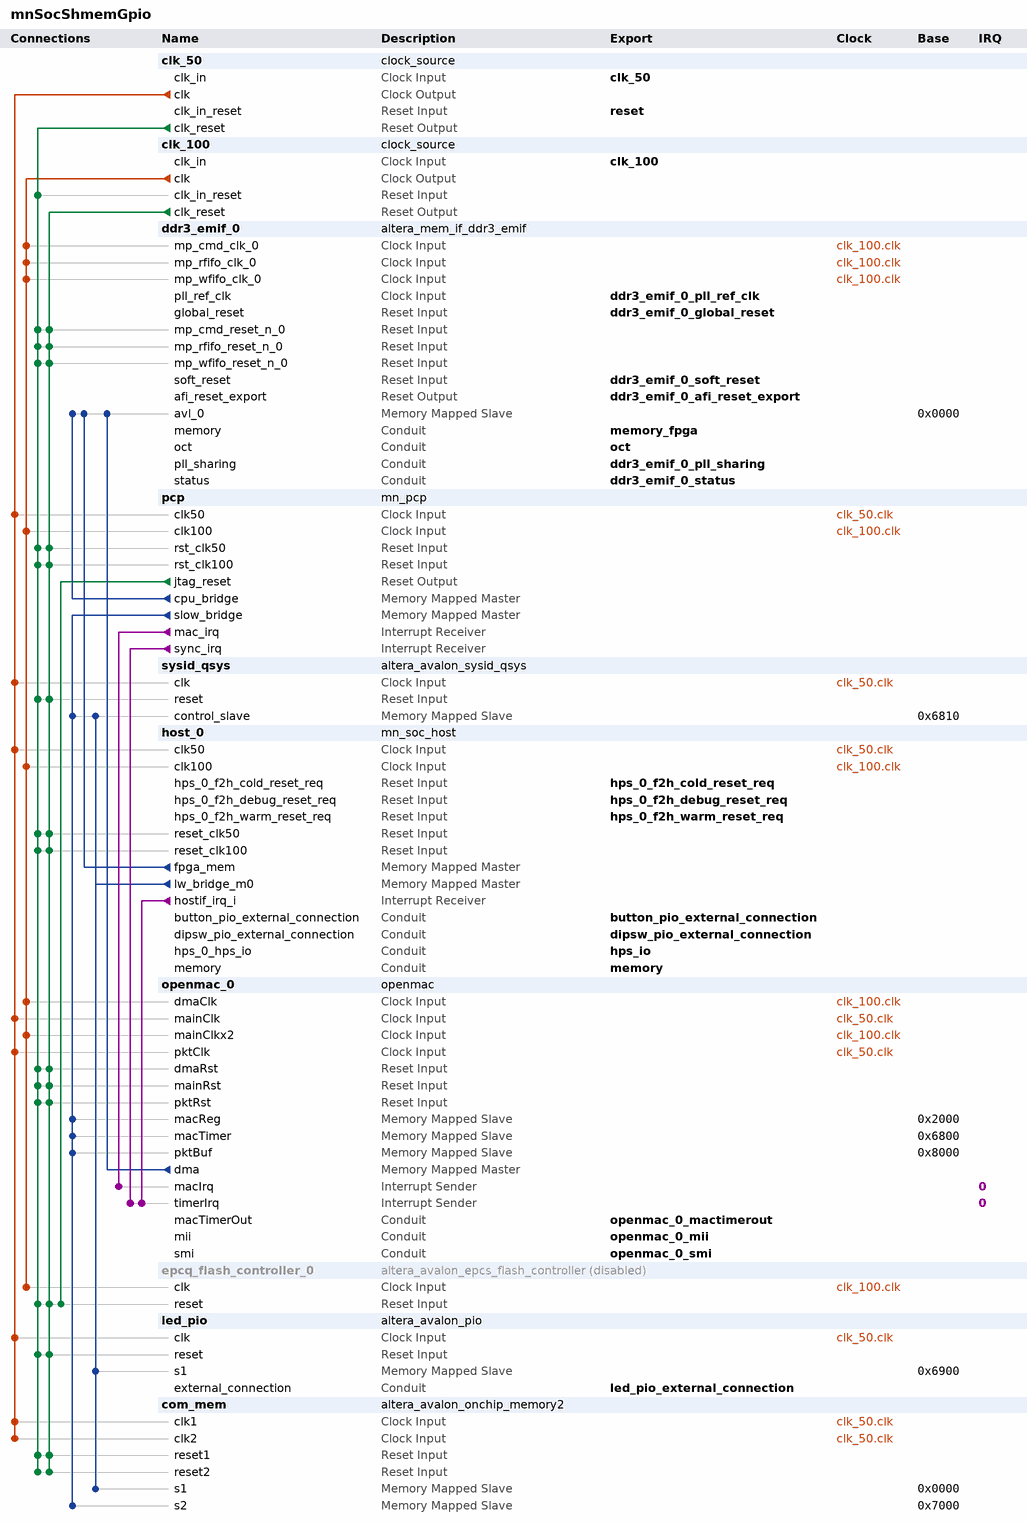
[diagram p0: system contents]
# Platform Designer (Qsys) system mnSocShmemGpio, Cyclone V 5CSXFC6D6F31C6
# Parameters at their usual value, and those the tool derives, are not listed.
package require -exact qsys 14.1
create_system mnSocShmemGpio
set_project_property DEVICE_FAMILY {Cyclone V}
set_project_property DEVICE 5CSXFC6D6F31C6

add_instance clk_50 clock_source 14.1
set_instance_parameter_value clk_50 clockFrequency 50000000
set_instance_parameter_value clk_50 resetSynchronousEdges DEASSERT

add_instance clk_100 clock_source 14.1
set_instance_parameter_value clk_100 clockFrequency 100000000

add_instance ddr3_emif_0 altera_mem_if_ddr3_emif 14.1
set_instance_parameter_value ddr3_emif_0 ADDR_ORDER 2
set_instance_parameter_value ddr3_emif_0 AVL_MAX_SIZE 1
set_instance_parameter_value ddr3_emif_0 CALIBRATION_MODE Skip
set_instance_parameter_value ddr3_emif_0 CPORT_TYPE_PORT Bidirectional,Bidirectional,Bidirectional,Bidirectional,Bidirectional,Bidirectional
set_instance_parameter_value ddr3_emif_0 EXPORT_AFI_HALF_CLK true
set_instance_parameter_value ddr3_emif_0 HARD_EMIF true
set_instance_parameter_value ddr3_emif_0 MEM_BANKADDR_WIDTH 3
set_instance_parameter_value ddr3_emif_0 MEM_CLK_FREQ 300.0
set_instance_parameter_value ddr3_emif_0 MEM_CLK_FREQ_MAX 800.0
set_instance_parameter_value ddr3_emif_0 MEM_COL_ADDR_WIDTH 10
set_instance_parameter_value ddr3_emif_0 MEM_DQ_WIDTH 32
set_instance_parameter_value ddr3_emif_0 MEM_DRV_STR RZQ/6
set_instance_parameter_value ddr3_emif_0 MEM_FORMAT DISCRETE
set_instance_parameter_value ddr3_emif_0 MEM_ROW_ADDR_WIDTH 12
set_instance_parameter_value ddr3_emif_0 MEM_RTT_NOM {ODT Disabled}
set_instance_parameter_value ddr3_emif_0 MEM_RTT_WR {Dynamic ODT off}
set_instance_parameter_value ddr3_emif_0 MEM_TCL 6
set_instance_parameter_value ddr3_emif_0 MEM_TFAW_NS 40.0
set_instance_parameter_value ddr3_emif_0 MEM_TRAS_NS 35.0
set_instance_parameter_value ddr3_emif_0 MEM_TRCD_NS 13.75
set_instance_parameter_value ddr3_emif_0 MEM_TRFC_NS 260.0
set_instance_parameter_value ddr3_emif_0 MEM_TRP_NS 13.75
set_instance_parameter_value ddr3_emif_0 MEM_TRRD_NS 13.5
set_instance_parameter_value ddr3_emif_0 MEM_TRTP_NS 13.5
set_instance_parameter_value ddr3_emif_0 MEM_TWTR 4
set_instance_parameter_value ddr3_emif_0 MEM_VENDOR Micron
set_instance_parameter_value ddr3_emif_0 MEM_WTCL 5
set_instance_parameter_value ddr3_emif_0 PLL_LOCATION Top_Bottom
set_instance_parameter_value ddr3_emif_0 POWER_OF_TWO_BUS false
set_instance_parameter_value ddr3_emif_0 PRIORITY_PORT 1,1,1,1,1,1
set_instance_parameter_value ddr3_emif_0 RATE Full
set_instance_parameter_value ddr3_emif_0 REF_CLK_FREQ 50.0
set_instance_parameter_value ddr3_emif_0 SPEED_GRADE 8
set_instance_parameter_value ddr3_emif_0 TIMING_BOARD_AC_SKEW 0.02
set_instance_parameter_value ddr3_emif_0 TIMING_BOARD_AC_TO_CK_SKEW 0.0
set_instance_parameter_value ddr3_emif_0 TIMING_BOARD_DQ_TO_DQS_SKEW 0.0
set_instance_parameter_value ddr3_emif_0 TIMING_BOARD_MAX_CK_DELAY 0.6
set_instance_parameter_value ddr3_emif_0 TIMING_BOARD_MAX_DQS_DELAY 0.6
set_instance_parameter_value ddr3_emif_0 TIMING_BOARD_SKEW_BETWEEN_DQS 0.02
set_instance_parameter_value ddr3_emif_0 TIMING_BOARD_SKEW_CKDQS_DIMM_MAX 0.01
set_instance_parameter_value ddr3_emif_0 TIMING_BOARD_SKEW_CKDQS_DIMM_MIN -0.01
set_instance_parameter_value ddr3_emif_0 TIMING_BOARD_SKEW_WITHIN_DQS 0.02
set_instance_parameter_value ddr3_emif_0 TIMING_TDH 45
set_instance_parameter_value ddr3_emif_0 TIMING_TDQSCK 255
set_instance_parameter_value ddr3_emif_0 TIMING_TDQSQ 100
set_instance_parameter_value ddr3_emif_0 TIMING_TDQSS 0.27
set_instance_parameter_value ddr3_emif_0 TIMING_TDS 10
set_instance_parameter_value ddr3_emif_0 TIMING_TDSH 0.18
set_instance_parameter_value ddr3_emif_0 TIMING_TDSS 0.18
set_instance_parameter_value ddr3_emif_0 TIMING_TIH 120
set_instance_parameter_value ddr3_emif_0 TIMING_TIS 170
set_instance_parameter_value ddr3_emif_0 TIMING_TQSH 0.4
set_instance_parameter_value ddr3_emif_0 USER_DEBUG_LEVEL 0

add_instance pcp mn_pcp 1.0

add_instance sysid_qsys altera_avalon_sysid_qsys 14.1
set_instance_parameter_value sysid_qsys id -1395322092

add_instance host_0 mn_soc_host 1.0

add_instance openmac_0 openmac 1.0.2
set_instance_parameter_value openmac_0 gui_actEn false
set_instance_parameter_value openmac_0 gui_extraSmi false
set_instance_parameter_value openmac_0 gui_phyCount 2
set_instance_parameter_value openmac_0 gui_phyType 2
set_instance_parameter_value openmac_0 gui_rxBurstSize 8
set_instance_parameter_value openmac_0 gui_sdcEn true
set_instance_parameter_value openmac_0 gui_tmrCount 1
set_instance_parameter_value openmac_0 gui_txBufLoc 1
set_instance_parameter_value openmac_0 gui_txBufSize 16
set_instance_parameter_value openmac_0 gui_txBurstSize 1

add_instance epcq_flash_controller_0 altera_avalon_epcs_flash_controller 14.1
set_instance_property epcq_flash_controller_0 ENABLED false
set_instance_parameter_value epcq_flash_controller_0 resetrequest_enabled true

add_instance led_pio altera_avalon_pio 14.1
set_instance_parameter_value led_pio bitModifyingOutReg true
set_instance_parameter_value led_pio direction Output
set_instance_parameter_value led_pio width 4

add_instance com_mem altera_avalon_onchip_memory2 14.1
set_instance_parameter_value com_mem dataWidth 32
set_instance_parameter_value com_mem dualPort true
set_instance_parameter_value com_mem initMemContent true
set_instance_parameter_value com_mem initializationFileName onchip_mem.hex
set_instance_parameter_value com_mem memorySize 4096

# connections
add_connection clk_50.clk com_mem.clk1 clock
add_connection clk_50.clk com_mem.clk2 clock
add_connection clk_50.clk host_0.clk50 clock
add_connection clk_50.clk led_pio.clk clock
add_connection clk_50.clk openmac_0.mainClk clock
add_connection clk_50.clk openmac_0.pktClk clock
add_connection clk_50.clk pcp.clk50 clock
add_connection clk_50.clk sysid_qsys.clk clock
add_connection clk_100.clk ddr3_emif_0.mp_cmd_clk_0 clock
add_connection clk_100.clk ddr3_emif_0.mp_rfifo_clk_0 clock
add_connection clk_100.clk ddr3_emif_0.mp_wfifo_clk_0 clock
add_connection clk_100.clk epcq_flash_controller_0.clk clock
add_connection clk_100.clk host_0.clk100 clock
add_connection clk_100.clk openmac_0.dmaClk clock
add_connection clk_100.clk openmac_0.mainClkx2 clock
add_connection clk_100.clk pcp.clk100 clock
add_connection clk_50.clk_reset clk_100.clk_in_reset reset
add_connection clk_50.clk_reset com_mem.reset1 reset
add_connection clk_50.clk_reset com_mem.reset2 reset
add_connection clk_50.clk_reset ddr3_emif_0.mp_cmd_reset_n_0 reset
add_connection clk_50.clk_reset ddr3_emif_0.mp_rfifo_reset_n_0 reset
add_connection clk_50.clk_reset ddr3_emif_0.mp_wfifo_reset_n_0 reset
add_connection clk_50.clk_reset epcq_flash_controller_0.reset reset
add_connection clk_50.clk_reset host_0.reset_clk50 reset
add_connection clk_50.clk_reset host_0.reset_clk100 reset
add_connection clk_50.clk_reset led_pio.reset reset
add_connection clk_50.clk_reset openmac_0.dmaRst reset
add_connection clk_50.clk_reset openmac_0.mainRst reset
add_connection clk_50.clk_reset openmac_0.pktRst reset
add_connection clk_50.clk_reset pcp.rst_clk50 reset
add_connection clk_50.clk_reset pcp.rst_clk100 reset
add_connection clk_50.clk_reset sysid_qsys.reset reset
add_connection clk_100.clk_reset com_mem.reset1 reset
add_connection clk_100.clk_reset com_mem.reset2 reset
add_connection clk_100.clk_reset ddr3_emif_0.mp_cmd_reset_n_0 reset
add_connection clk_100.clk_reset ddr3_emif_0.mp_rfifo_reset_n_0 reset
add_connection clk_100.clk_reset ddr3_emif_0.mp_wfifo_reset_n_0 reset
add_connection clk_100.clk_reset epcq_flash_controller_0.reset reset
add_connection clk_100.clk_reset host_0.reset_clk50 reset
add_connection clk_100.clk_reset host_0.reset_clk100 reset
add_connection clk_100.clk_reset led_pio.reset reset
add_connection clk_100.clk_reset openmac_0.dmaRst reset
add_connection clk_100.clk_reset openmac_0.mainRst reset
add_connection clk_100.clk_reset openmac_0.pktRst reset
add_connection clk_100.clk_reset pcp.rst_clk50 reset
add_connection clk_100.clk_reset pcp.rst_clk100 reset
add_connection clk_100.clk_reset sysid_qsys.reset reset
add_connection pcp.jtag_reset epcq_flash_controller_0.reset reset
add_connection host_0.fpga_mem ddr3_emif_0.avl_0 avalon
set_connection_parameter_value host_0.fpga_mem/ddr3_emif_0.avl_0 baseAddress 0x0000
add_connection host_0.lw_bridge_m0 com_mem.s1 avalon
set_connection_parameter_value host_0.lw_bridge_m0/com_mem.s1 baseAddress 0x0000
add_connection host_0.lw_bridge_m0 led_pio.s1 avalon
set_connection_parameter_value host_0.lw_bridge_m0/led_pio.s1 baseAddress 0x6900
add_connection host_0.lw_bridge_m0 sysid_qsys.control_slave avalon
set_connection_parameter_value host_0.lw_bridge_m0/sysid_qsys.control_slave baseAddress 0x6810
add_connection openmac_0.dma ddr3_emif_0.avl_0 avalon
set_connection_parameter_value openmac_0.dma/ddr3_emif_0.avl_0 baseAddress 0x0000
add_connection pcp.cpu_bridge ddr3_emif_0.avl_0 avalon
set_connection_parameter_value pcp.cpu_bridge/ddr3_emif_0.avl_0 baseAddress 0x0000
add_connection pcp.slow_bridge com_mem.s2 avalon
set_connection_parameter_value pcp.slow_bridge/com_mem.s2 baseAddress 0x7000
add_connection pcp.slow_bridge openmac_0.macReg avalon
set_connection_parameter_value pcp.slow_bridge/openmac_0.macReg baseAddress 0x2000
add_connection pcp.slow_bridge openmac_0.macTimer avalon
set_connection_parameter_value pcp.slow_bridge/openmac_0.macTimer baseAddress 0x6800
add_connection pcp.slow_bridge openmac_0.pktBuf avalon
set_connection_parameter_value pcp.slow_bridge/openmac_0.pktBuf baseAddress 0x8000
add_connection pcp.slow_bridge sysid_qsys.control_slave avalon
set_connection_parameter_value pcp.slow_bridge/sysid_qsys.control_slave baseAddress 0x6810
add_connection host_0.hostif_irq_i openmac_0.timerIrq interrupt
set_connection_parameter_value host_0.hostif_irq_i/openmac_0.timerIrq irqNumber 0
add_connection pcp.mac_irq openmac_0.macIrq interrupt
set_connection_parameter_value pcp.mac_irq/openmac_0.macIrq irqNumber 0
add_connection pcp.sync_irq openmac_0.timerIrq interrupt
set_connection_parameter_value pcp.sync_irq/openmac_0.timerIrq irqNumber 0

# exported interfaces
add_interface button_pio_external_connection conduit end
set_interface_property button_pio_external_connection EXPORT_OF host_0.button_pio_external_connection
add_interface clk_100 clock sink
set_interface_property clk_100 EXPORT_OF clk_100.clk_in
add_interface clk_50 clock sink
set_interface_property clk_50 EXPORT_OF clk_50.clk_in
add_interface ddr3_emif_0_afi_reset_export reset source
set_interface_property ddr3_emif_0_afi_reset_export EXPORT_OF ddr3_emif_0.afi_reset_export
add_interface ddr3_emif_0_global_reset reset sink
set_interface_property ddr3_emif_0_global_reset EXPORT_OF ddr3_emif_0.global_reset
add_interface ddr3_emif_0_pll_ref_clk clock sink
set_interface_property ddr3_emif_0_pll_ref_clk EXPORT_OF ddr3_emif_0.pll_ref_clk
add_interface ddr3_emif_0_pll_sharing conduit end
set_interface_property ddr3_emif_0_pll_sharing EXPORT_OF ddr3_emif_0.pll_sharing
add_interface ddr3_emif_0_soft_reset reset sink
set_interface_property ddr3_emif_0_soft_reset EXPORT_OF ddr3_emif_0.soft_reset
add_interface ddr3_emif_0_status conduit end
set_interface_property ddr3_emif_0_status EXPORT_OF ddr3_emif_0.status
add_interface dipsw_pio_external_connection conduit end
set_interface_property dipsw_pio_external_connection EXPORT_OF host_0.dipsw_pio_external_connection
add_interface hps_0_f2h_cold_reset_req reset sink
set_interface_property hps_0_f2h_cold_reset_req EXPORT_OF host_0.hps_0_f2h_cold_reset_req
add_interface hps_0_f2h_debug_reset_req reset sink
set_interface_property hps_0_f2h_debug_reset_req EXPORT_OF host_0.hps_0_f2h_debug_reset_req
add_interface hps_0_f2h_warm_reset_req reset sink
set_interface_property hps_0_f2h_warm_reset_req EXPORT_OF host_0.hps_0_f2h_warm_reset_req
add_interface hps_io conduit end
set_interface_property hps_io EXPORT_OF host_0.hps_0_hps_io
add_interface led_pio_external_connection conduit end
set_interface_property led_pio_external_connection EXPORT_OF led_pio.external_connection
add_interface memory conduit end
set_interface_property memory EXPORT_OF host_0.memory
add_interface memory_fpga conduit end
set_interface_property memory_fpga EXPORT_OF ddr3_emif_0.memory
add_interface oct conduit end
set_interface_property oct EXPORT_OF ddr3_emif_0.oct
add_interface openmac_0_mactimerout conduit end
set_interface_property openmac_0_mactimerout EXPORT_OF openmac_0.macTimerOut
add_interface openmac_0_mii conduit end
set_interface_property openmac_0_mii EXPORT_OF openmac_0.mii
add_interface openmac_0_smi conduit end
set_interface_property openmac_0_smi EXPORT_OF openmac_0.smi
add_interface reset reset sink
set_interface_property reset EXPORT_OF clk_50.clk_in_reset

set_interconnect_requirement {$system} qsys_mm.clockCrossingAdapter HANDSHAKE
set_interconnect_requirement {$system} qsys_mm.insertDefaultSlave false
set_interconnect_requirement {$system} qsys_mm.maxAdditionalLatency 1

save_system mnSocShmemGpio.qsys
